# Altium schematic sheet CPU.SchDoc: Motherboard-CPU
size A3; Author: Patryk Bujak; DrawnBy: Patryk Bujak; Revision: 1.0; SheetNumber: 3; SheetTotal: 10
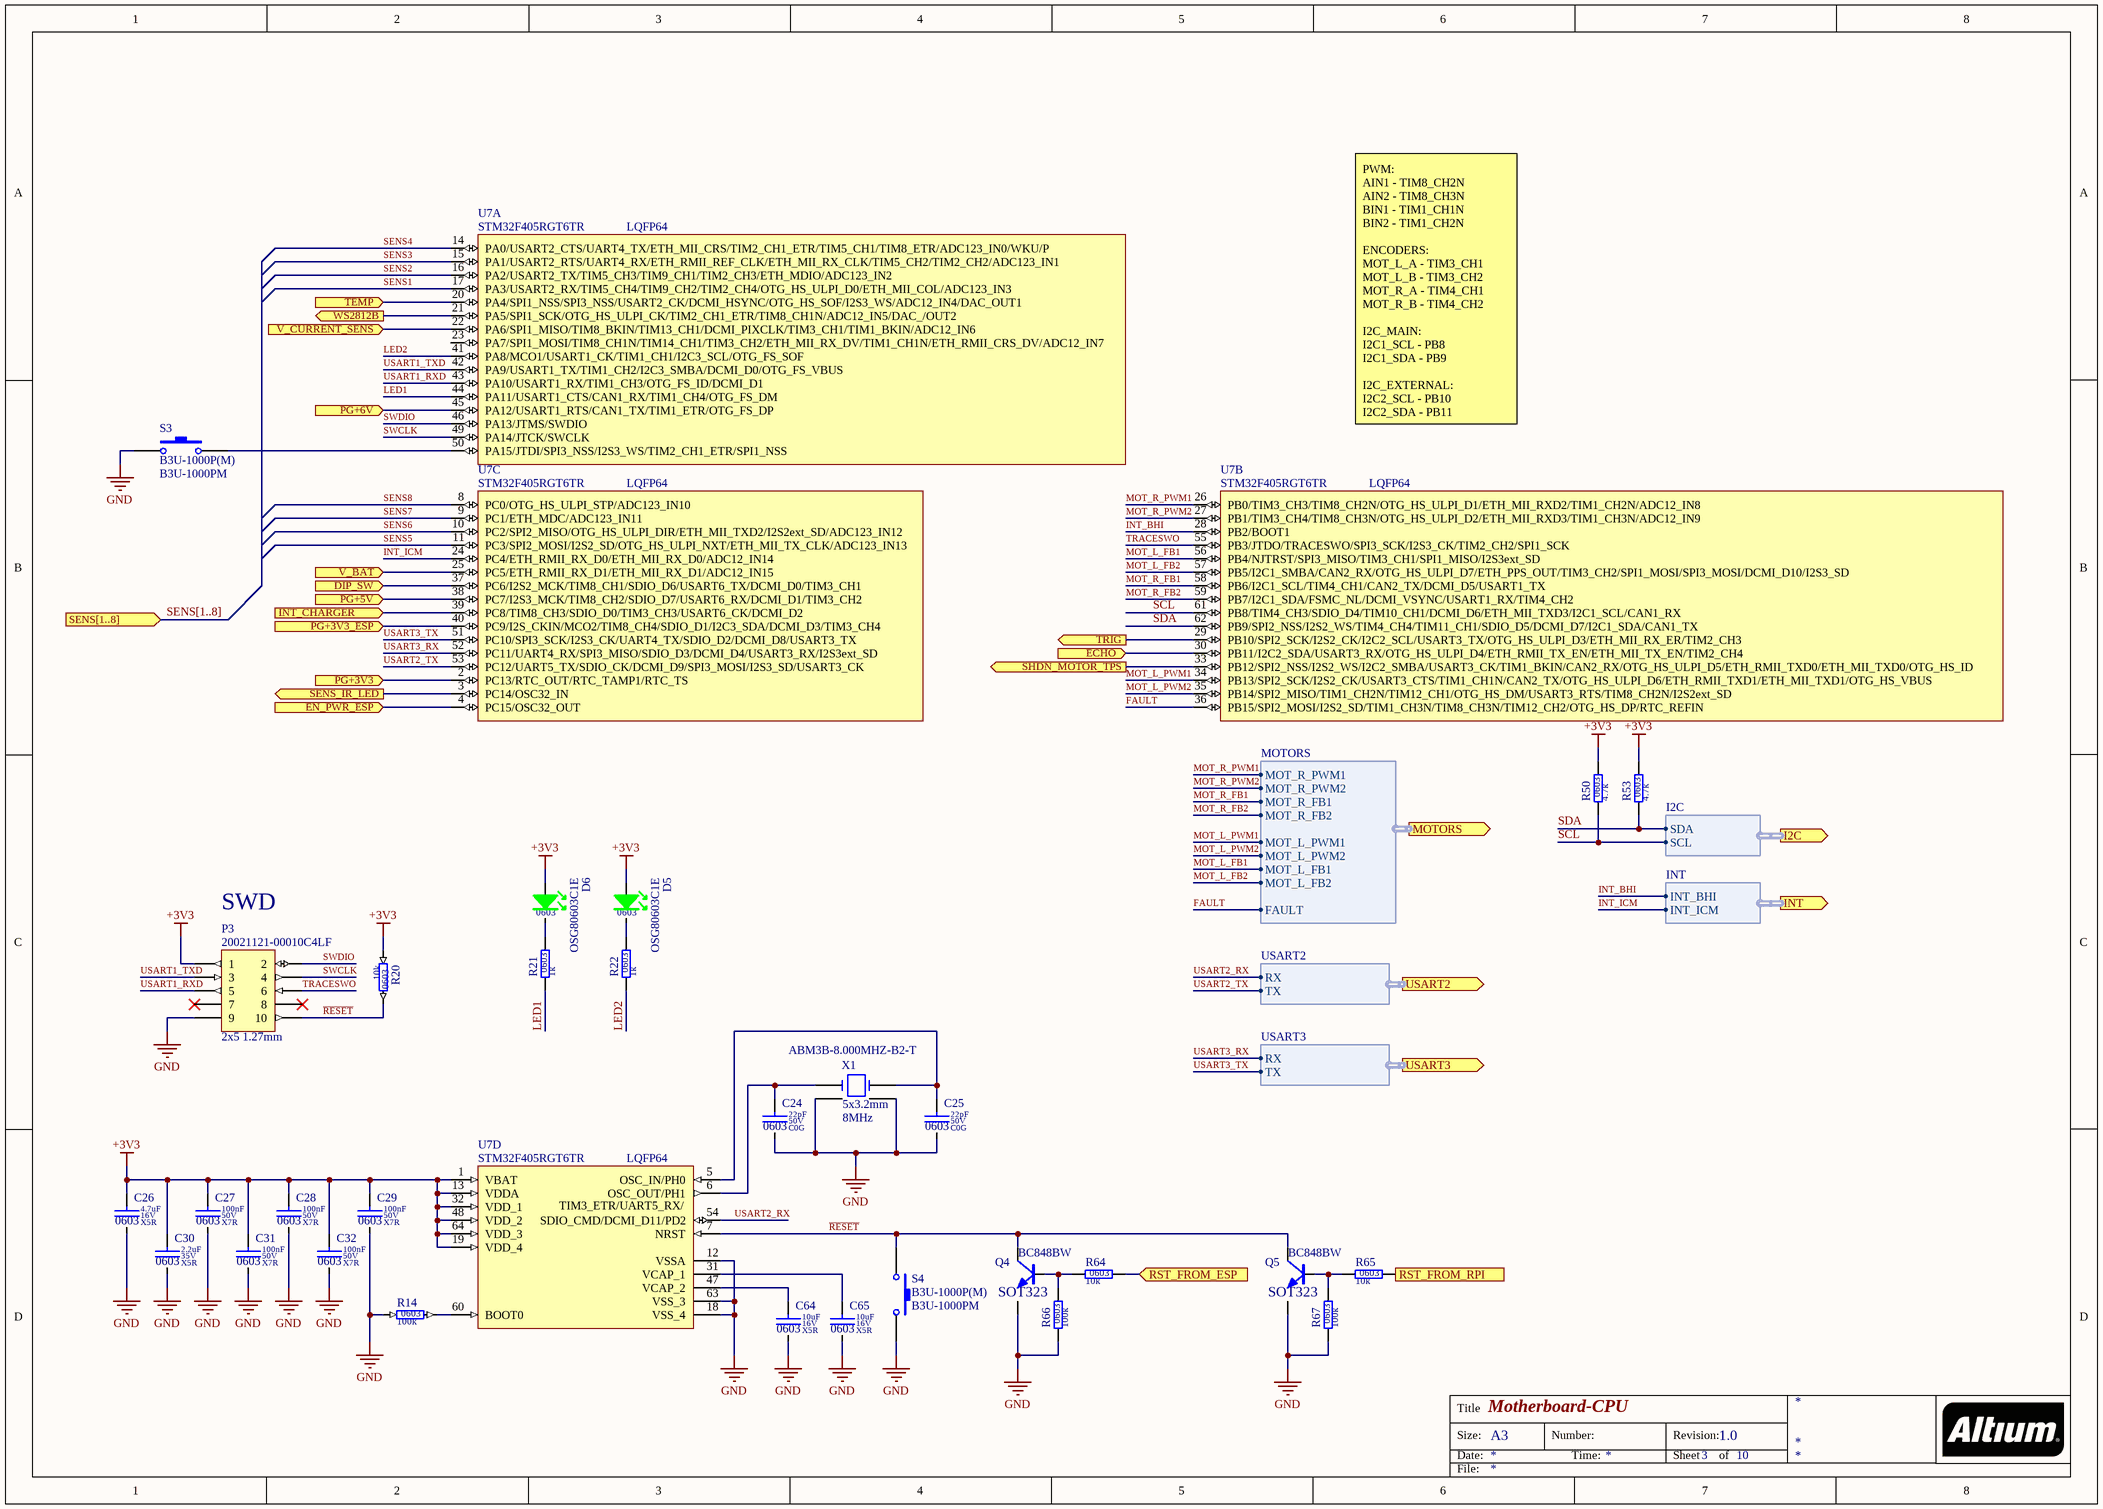
[diagram p0: CPU.SchDoc]

## Parts
C24  value 22pF  Dielectric: C0G  Voltage: 50V  SCH_Footprint: 0603  [C_0603_1608]  (hidden comment: Ceramic C0G)
C25  value 22pF  Dielectric: C0G  Voltage: 50V  SCH_Footprint: 0603  [C_0603_1608]  (hidden comment: Ceramic C0G)
C26  value 4.7uF  Dielectric: X5R  Voltage: 16V  SCH_Footprint: 0603  [C_0603_1608]  (hidden comment: Ceramic X5R)
C27  value 100nF  Dielectric: X7R  Voltage: 50V  SCH_Footprint: 0603  [C_0603_1608]  (hidden comment: Ceramic X7R)
C28  value 100nF  Dielectric: X7R  Voltage: 50V  SCH_Footprint: 0603  [C_0603_1608]  (hidden comment: Ceramic X7R)
C29  value 100nF  Dielectric: X7R  Voltage: 50V  SCH_Footprint: 0603  [C_0603_1608]  (hidden comment: Ceramic X7R)
C30  value 2.2uF  Dielectric: X5R  Voltage: 35V  SCH_Footprint: 0603  [C_0603_1608]  (hidden comment: Ceramic X5R)
C31  value 100nF  Dielectric: X7R  Voltage: 50V  SCH_Footprint: 0603  [C_0603_1608]  (hidden comment: Ceramic X7R)
C32  value 100nF  Dielectric: X7R  Voltage: 50V  SCH_Footprint: 0603  [C_0603_1608]  (hidden comment: Ceramic X7R)
C64  value 10uF  Dielectric: X5R  Voltage: 16V  SCH_Footprint: 0603  [C_0603_1608]  (hidden comment: Ceramic X5R)
C65  value 10uF  Dielectric: X5R  Voltage: 16V  SCH_Footprint: 0603  [C_0603_1608]  (hidden comment: Ceramic X5R)
D5  value OSG80603C1E  SCH_Footprint: 0603  [OL_0603_1608]  (hidden comment: Green led)
D6  value OSG80603C1E  SCH_Footprint: 0603  [OL_0603_1608]  (hidden comment: Green led)
P3  value 20021121-00010C4LF  SCH_Footprint: 2x5 1.27mm  [P_HEADER_2x5_1.27]  (hidden comment: Jtag)
Q4  SCH_Footprint: SOT323  [SOT323_SC70]  (hidden comment: BC848BW)
Q5  SCH_Footprint: SOT323  [SOT323_SC70]  (hidden comment: BC848BW)
R14  value 100k  SCH_Footprint: 0603  [R_0603_1608]  (hidden comment: Resistor)
R20  value 10k  SCH_Footprint: 0603  [R_0603_1608]  (hidden comment: Resistor)
R21  value 1k  SCH_Footprint: 0603  [R_0603_1608]  (hidden comment: Resistor)
R22  value 1k  SCH_Footprint: 0603  [R_0603_1608]  (hidden comment: Resistor)
R50  value 4.7k  SCH_Footprint: 0603  [R_0603_1608]  (hidden comment: Resistor)
R53  value 4.7k  SCH_Footprint: 0603  [R_0603_1608]  (hidden comment: Resistor)
R64  value 10k  SCH_Footprint: 0603  [R_0603_1608]  (hidden comment: Resistor)
R65  value 10k  SCH_Footprint: 0603  [R_0603_1608]  (hidden comment: Resistor)
R66  value 100k  SCH_Footprint: 0603  [R_0603_1608]  (hidden comment: Resistor)
R67  value 100k  SCH_Footprint: 0603  [R_0603_1608]  (hidden comment: Resistor)
S3  value B3U-1000PM  SCH_Footprint: B3U-1000P(M)  [B3U-1000P]  (hidden comment: Ultra-small Tactile Switch)
S4  value B3U-1000PM  SCH_Footprint: B3U-1000P(M)  [B3U-1000P]  (hidden comment: Ultra-small Tactile Switch)
U7  value STM32F405RGT6TR  SCH_Footprint: LQFP64  [LQFP64_10x10]  (hidden comment: STM32F405RBT6)  (parts A,B,C,D of 4)
X1  Manufacturer Part Number: ABM3B-8.000MHZ-B2-T  SCH_Footprint: 5x3.2mm  [X_ABM3B_5X3X11]  (hidden comment: 8MHz)

## Ports
DIP_SW (in), ECHO (in), EN_PWR_ESP (in), I2C (out, harness I2C), INT (out, harness INT), INT_CHARGER (in), MOTORS (out, harness MOTORS), PG+3V3 (in), PG+3V3_ESP (in), PG+5V (in), PG+6V (in), RST_FROM_ESP (in), RST_FROM_RPI (in), SENS[1..8] (in), SENS_IR_LED (out), SHDN_MOTOR_TPS (out), TEMP (in), TRIG (out), USART2 (out, harness USART2), USART3 (out, harness USART3), V_BAT (in), V_CURRENT_SENS (in), WS2812B (out)

## Harnesses
MOTORS: MOT_R_PWM2, MOT_L_PWM1, MOT_L_PWM2, MOT_R_PWM1, MOT_R_FB1, MOT_R_FB2, MOT_L_FB1, MOT_L_FB2, FAULT
I2C: SDA, SCL
INT: INT_BHI, INT_ICM
USART2: RX, TX
USART3: RX, TX

## Nets
+3V3: C26.1 C27.1 C28.1 C29.1 C30.1 C31.1 C32.1 D5.2(A) D6.2(A) P3.1 R20.1 R50.2 R53.2 U7.1(VBAT) U7.13(VDDA) U7.19(VDD_4) U7.32(VDD_1) U7.48(VDD_2) U7.64(VDD_3)
GND: C24.2 C25.2 C26.2 C27.2 C28.2 C29.2 C30.2 C31.2 C32.2 C64.2 C65.2 P3.9 Q4.2(E) Q5.2(E) R14.1 R66.1 R67.1 S3.1 S4.2 U7.12(VSSA) U7.18(VSS_4) U7.63(VSS_3) X1.2(GND) X1.4(GND)
DIP_SW: U7.37(PC6/I2S2_MCK/TIM8_CH1/SDIO_D6/USART6_TX/DCMI_D0/TIM3_CH1) ; port DIP_SW
ECHO: U7.30(PB11/I2C2_SDA/USART3_RX/OTG_HS_ULPI_D4/ETH_RMII_TX_EN/ETH_MII_TX_EN/TIM2_CH4) ; port ECHO
EN_PWR_ESP: U7.4(PC15/OSC32_OUT) ; port EN_PWR_ESP
FAULT: U7.36(PB15/SPI2_MOSI/I2S2_SD/TIM1_CH3N/TIM8_CH3N/TIM12_CH2/OTG_HS_DP/RTC_REFIN) ; port MOTORS.FAULT
INT_BHI: U7.28(PB2/BOOT1) ; port INT.INT_BHI
INT_CHARGER: U7.39(PC8/TIM8_CH3/SDIO_D0/TIM3_CH3/USART6_CK/DCMI_D2) ; port INT_CHARGER
INT_ICM: U7.24(PC4/ETH_RMII_RX_D0/ETH_MII_RX_D0/ADC12_IN14) ; port INT.INT_ICM
LED1: R21.1 U7.44(PA11/USART1_CTS/CAN1_RX/TIM1_CH4/OTG_FS_DM)
LED2: R22.1 U7.41(PA8/MCO1/USART1_CK/TIM1_CH1/I2C3_SCL/OTG_FS_SOF)
MOT_L_FB1: U7.56(PB4/NJTRST/SPI3_MISO/TIM3_CH1/SPI1_MISO/I2S3ext_SD) ; port MOTORS.MOT_L_FB1
MOT_L_FB2: U7.57(PB5/I2C1_SMBA/CAN2_RX/OTG_HS_ULPI_D7/ETH_PPS_OUT/TIM3_CH2/SPI1_MOSI/SPI3_MOSI/DCMI_D10/I2S3_SD) ; port MOTORS.MOT_L_FB2
MOT_L_PWM1: U7.34(PB13/SPI2_SCK/I2S2_CK/USART3_CTS/TIM1_CH1N/CAN2_TX/OTG_HS_ULPI_D6/ETH_RMII_TXD1/ETH_MII_TXD1/OTG_HS_VBUS) ; port MOTORS.MOT_L_PWM1
MOT_L_PWM2: U7.35(PB14/SPI2_MISO/TIM1_CH2N/TIM12_CH1/OTG_HS_DM/USART3_RTS/TIM8_CH2N/I2S2ext_SD) ; port MOTORS.MOT_L_PWM2
MOT_R_FB1: U7.58(PB6/I2C1_SCL/TIM4_CH1/CAN2_TX/DCMI_D5/USART1_TX) ; port MOTORS.MOT_R_FB1
MOT_R_FB2: U7.59(PB7/I2C1_SDA/FSMC_NL/DCMI_VSYNC/USART1_RX/TIM4_CH2) ; port MOTORS.MOT_R_FB2
MOT_R_PWM1: U7.26(PB0/TIM3_CH3/TIM8_CH2N/OTG_HS_ULPI_D1/ETH_MII_RXD2/TIM1_CH2N/ADC12_IN8) ; port MOTORS.MOT_R_PWM1
MOT_R_PWM2: U7.27(PB1/TIM3_CH4/TIM8_CH3N/OTG_HS_ULPI_D2/ETH_MII_RXD3/TIM1_CH3N/ADC12_IN9) ; port MOTORS.MOT_R_PWM2
PG+3V3: U7.2(PC13/RTC_OUT/RTC_TAMP1/RTC_TS) ; port PG+3V3
PG+3V3_ESP: U7.40(PC9/I2S_CKIN/MCO2/TIM8_CH4/SDIO_D1/I2C3_SDA/DCMI_D3/TIM3_CH4) ; port PG+3V3_ESP
PG+5V: U7.38(PC7/I2S3_MCK/TIM8_CH2/SDIO_D7/USART6_RX/DCMI_D1/TIM3_CH2) ; port PG+5V
PG+6V: U7.45(PA12/USART1_RTS/CAN1_TX/TIM1_ETR/OTG_FS_DP) ; port PG+6V
~{RESET}: P3.10 Q4.3(C) Q5.3(C) R20.2 S4.1 U7.7(NRST)
RST_FROM_ESP: R64.2 ; port RST_FROM_ESP
RST_FROM_RPI: R65.2 ; port RST_FROM_RPI
SCL: R50.1 U7.61(PB8/TIM4_CH3/SDIO_D4/TIM10_CH1/DCMI_D6/ETH_MII_TXD3/I2C1_SCL/CAN1_RX) ; port I2C.SCL
SDA: R53.1 U7.62(PB9/SPI2_NSS/I2S2_WS/TIM4_CH4/TIM11_CH1/SDIO_D5/DCMI_D7/I2C1_SDA/CAN1_TX) ; port I2C.SDA
SENS1: U7.17(PA3/USART2_RX/TIM5_CH4/TIM9_CH2/TIM2_CH4/OTG_HS_ULPI_D0/ETH_MII_COL/ADC123_IN3)
SENS2: U7.16(PA2/USART2_TX/TIM5_CH3/TIM9_CH1/TIM2_CH3/ETH_MDIO/ADC123_IN2)
SENS3: U7.15(PA1/USART2_RTS/UART4_RX/ETH_RMII_REF_CLK/ETH_MII_RX_CLK/TIM5_CH2/TIM2_CH2/ADC123_IN1)
SENS4: U7.14(PA0/USART2_CTS/UART4_TX/ETH_MII_CRS/TIM2_CH1_ETR/TIM5_CH1/TIM8_ETR/ADC123_IN0/WKU/P)
SENS5: U7.11(PC3/SPI2_MOSI/I2S2_SD/OTG_HS_ULPI_NXT/ETH_MII_TX_CLK/ADC123_IN13)
SENS6: U7.10(PC2/SPI2_MISO/OTG_HS_ULPI_DIR/ETH_MII_TXD2/I2S2ext_SD/ADC123_IN12)
SENS7: U7.9(PC1/ETH_MDC/ADC123_IN11)
SENS8: U7.8(PC0/OTG_HS_ULPI_STP/ADC123_IN10)
SENS_IR_LED: U7.3(PC14/OSC32_IN) ; port SENS_IR_LED
SHDN_MOTOR_TPS: U7.33(PB12/SPI2_NSS/I2S2_WS/I2C2_SMBA/USART3_CK/TIM1_BKIN/CAN2_RX/OTG_HS_ULPI_D5/ETH_RMII_TXD0/ETH_MII_TXD0/OTG_HS_ID) ; port SHDN_MOTOR_TPS
SWCLK: P3.4 U7.49(PA14/JTCK/SWCLK)
SWDIO: P3.2 U7.46(PA13/JTMS/SWDIO)
TEMP: U7.20(PA4/SPI1_NSS/SPI3_NSS/USART2_CK/DCMI_HSYNC/OTG_HS_SOF/I2S3_WS/ADC12_IN4/DAC_OUT1) ; port TEMP
TRACESWO: P3.6 U7.55(PB3/JTDO/TRACESWO/SPI3_SCK/I2S3_CK/TIM2_CH2/SPI1_SCK)
TRIG: U7.29(PB10/SPI2_SCK/I2S2_CK/I2C2_SCL/USART3_TX/OTG_HS_ULPI_D3/ETH_MII_RX_ER/TIM2_CH3) ; port TRIG
USART1_RXD: P3.5 U7.43(PA10/USART1_RX/TIM1_CH3/OTG_FS_ID/DCMI_D1)
USART1_TXD: P3.3 U7.42(PA9/USART1_TX/TIM1_CH2/I2C3_SMBA/DCMI_D0/OTG_FS_VBUS)
USART2_RX: U7.54(SDIO_CMD/DCMI_D11/PD2) ; port USART2.RX
USART2_TX: U7.53(PC12/UART5_TX/SDIO_CK/DCMI_D9/SPI3_MOSI/I2S3_SD/USART3_CK) ; port USART2.TX
USART3_RX: U7.52(PC11/UART4_RX/SPI3_MISO/SDIO_D3/DCMI_D4/USART3_RX/I2S3ext_SD) ; port USART3.RX
USART3_TX: U7.51(PC10/SPI3_SCK/I2S3_CK/UART4_TX/SDIO_D2/DCMI_D8/USART3_TX) ; port USART3.TX
V_BAT: U7.25(PC5/ETH_RMII_RX_D1/ETH_MII_RX_D1/ADC12_IN15) ; port V_BAT
V_CURRENT_SENS: U7.22(PA6/SPI1_MISO/TIM8_BKIN/TIM13_CH1/DCMI_PIXCLK/TIM3_CH1/TIM1_BKIN/ADC12_IN6) ; port V_CURRENT_SENS
WS2812B: U7.21(PA5/SPI1_SCK/OTG_HS_ULPI_CK/TIM2_CH1_ETR/TIM8_CH1N/ADC12_IN5/DAC_/OUT2) ; port WS2812B
NetC24_1: C24.1 U7.6(OSC_OUT/PH1) X1.3
NetC25_1: C25.1 U7.5(OSC_IN/PH0) X1.1
NetC64_1: C64.1 U7.47(VCAP_2)
NetC65_1: C65.1 U7.31(VCAP_1)
NetD5_1: D5.1(K) R22.2
NetD6_1: D6.1(K) R21.2
NetQ4_1: Q4.1(B) R64.1 R66.2
NetQ5_1: Q5.1(B) R65.1 R67.2
NetR14_2: R14.2 U7.60(BOOT0)
NetS3_2: S3.2 U7.50(PA15/JTDI/SPI3_NSS/I2S3_WS/TIM2_CH1_ETR/SPI1_NSS)

Not connected (* = marked no-connect by the designer): P3 7* 8*; U7 23(PA7/SPI1_MOSI/TIM8_CH1N/TIM14_CH1/TIM3_CH2/ETH_MII_RX_DV/TIM1_CH1N/ETH_RMII_CRS_DV/ADC12_IN7)

## Buses and harness runs
bus SENS[1..8] = port SENS[1..8]

## Notes on the sheet
- PWM:
  AIN1 - TIM8_CH2N
  AIN2 - TIM8_CH3N
  BIN1 - TIM1_CH1N
  BIN2 - TIM1_CH2N
  ENCODERS:
  MOT_L_A - TIM3_CH1
  MOT_L_B - TIM3_CH2
  MOT_R_A - TIM4_CH1
  MOT_R_B - TIM4_CH2
  I2C_MAIN:
  I2C1_SCL - PB8
  I2C1_SDA - PB9
  I2C_EXTERNAL:
  I2C2_SCL - PB10
  I2C2_SDA - PB11
- (near P3) SWD
- Title
- Size:
- Date:
- A3
- Number:
- Time:
- Revision:
- Sheet
- of
- File:
- (in symbol UP_STM32F405RGT6TR, part D) TIM3_ETR/UART5_RX/

## Library data of the parts
C24 C25 = C_22pF_50V_C0G_0603_5: Capacitor; Manufacturer: Yageo; Manufacturer Part Number: CC0603JRNPO9BN220; Tolerance (%): 5; Part Number: C_22pF_50V_C0G_0603_5; HelpURL: https://datasheet.octopart.com/CC0603JRNPO9BN220-Yageo-datasheet-136957424.pdf; Supplier 1: TME; Supplier Part Number 1: CC0603JRNPO9220; Supplier 2: RS Components; Supplier 3: Farnell; Supplier Part Number 3: 722005; Supplier 4: Mouser; Supplier Part Number 4: 603-CC603JRNPO9BN220; Supplier 5: Digi-Key; Supplier Part Number 5: 311-1062-1-ND; Supplier 6: LCSC
C26 = C_4.7uF_16V_X5R_0603_10: Capacitor; Manufacturer: Murata; Manufacturer Part Number: GRM188R61C475KAAJD; Tolerance (%): 10; Part Number: C_4.7uF_16V_X5R_0603_10; HelpURL: https://datasheet.octopart.com/GRM188R61C475KAAJD-Murata-datasheet-66077093.pdf; Supplier 1: TME; Supplier 2: RS Components; Supplier Part Number 2: 884-7264P; Supplier 3: Farnell; Supplier Part Number 3: 2611924; Supplier 4: Mouser; Supplier Part Number 4: 81-GRM188R61C475KAJD; Supplier 5: Digi-Key; Supplier Part Number 5: 490-10481-2-ND; Supplier 6: LCSC
C27-C29 C31 C32 = C_100nF_50V_X7R_0603_5: Capacitor; Manufacturer: Samsung; Manufacturer Part Number: CL10B104JB8NNNC; Tolerance (%): 5; Part Number: C_100nF_50V_X7R_0603_5; HelpURL: http://www.tme.eu/pl/Document/4a42202b32dab16128fe107dd69598cc/samsung-chip-cap.pdf; Supplier 1: TME; Supplier Part Number 1: CL10B104JB8NNNC; Supplier 2: RS Components; Supplier Part Number 2: 7665455; Supplier 3: Farnell; Supplier 4: Mouser; Supplier 5: Digi-Key; Supplier Part Number 5: 1276-1033-1-ND; Supplier 6: LCSC; Supplier Part Number 6: C24452
C30 = C_2.2uF_35V_X5R_0603_10: Capacitor; Manufacturer: Murata; Manufacturer Part Number: GRM188R6YA225KA12D; Tolerance (%): 10; Part Number: C_2.2uF_35V_X5R_0603_10; HelpURL: https://datasheet.octopart.com/GRM188R6YA225KA12D-Murata-datasheet-66077095.pdf; Supplier 1: TME; Supplier 2: RS Components; Supplier Part Number 2: 8151358; Supplier 3: Farnell; Supplier Part Number 3: 2611926; Supplier 4: Mouser; Supplier Part Number 4: 81-GRM188R6YA225KA2D; Supplier 5: Digi-Key; Supplier Part Number 5: 490-7204-1-ND; Supplier 6: LCSC
C64 C65 = C_10uF_16V_X5R_0603_20: Capacitor; Manufacturer: Samsung Electro-Mechanics; Manufacturer Part Number: CL10A106MO8NQNC; Tolerance (%): 20; Part Number: C_10uF_16V_X5R_0603_20; HelpURL: http://www.tme.eu/pl/Document/4a42202b32dab16128fe107dd69598cc/samsung-chip-cap.pdf; Supplier 1: TME; Supplier Part Number 1: CL10A106MO8NQNC; Supplier 2: RS Components; Supplier 3: Farnell; Supplier 4: Mouser; Supplier 5: Digi-Key; Supplier 6: LCSC
D5 D6 = OL_G_0603_OSG80603C1E: LED GREEN; Manufacturer: Optosupply; Part Number: OL_G_0603_OSG80603C1E; Manufacturer Part Number: OSG80603C1E; Supplier 1: TME; Supplier Part Number 1: OSG80603C1E; Supplier 2: RS Components; Supplier 3: Farnell; Supplier 4: Mouser; Supplier 5: Digi-Key; Supplier 6: LCSC
P3 = P_HEADER_2x5_1.27: Pin Header; Manufacturer: FCI; Part Number: P_HEADER_2x5_1.27; HelpURL: http://www.mouser.com/catalog/645/usd/1591.pdf; Manufacturer Part Number: 20021121-00010C4LF; Supplier 1: TME; Supplier Part Number 1: 20021121-00010C4LF; Supplier 2: RS Components; Supplier Part Number 2: 794-4584; Supplier 3: Farnell; Supplier Part Number 3: 1865279; Supplier 4: Mouser; Supplier Part Number 4: 649-202112100010C4LF; Supplier 5: Digi-Key; Supplier Part Number 5: 609-3695-1-ND; Supplier 6: LCSC
Q4 Q5 = QNP_BC848BW_30V_0A1: Manufacturer: Diotec Semiconductor; Type: NPN; Voltage: 30V; Current: 0A1; Part Number: QNP_BC848BW_30V_0A1; Value: BC848BW; HelpURL: http://www.tme.eu/pl/Document/6f749a16562a2a0770a5550dd3f478bf/bc846w.pdf; Manufacturer Part Number: BC848BW; Supplier 1: TME; Supplier Part Number 1: BC848BW-DIO; Supplier 2: RS Components; Supplier 3: Farnell; Supplier 4: Mouser; Supplier 5: Digi-Key; Supplier 6: LCSC
R14 R66 R67 = R_100k_0603_1: Manufacturer: Royalohm; Manufacturer Part Number: 0603SAF1003T5E; Voltage: 50V; Power: 100mW; Tolerance: 1%; Part Number: R_100k_0603_1; HelpURL: http://www.tme.eu/pl/Document/b315665a56acbc42df513c99b390ad98/ROYALOHM-THICKFILM.pdf; Supplier 1: TME; Supplier Part Number 1: SMD0603-100K-1%; Supplier 2: RS Components; Supplier 3: Farnell; Supplier 4: Mouser; Supplier Part Number 4: 667-ERJ-3EKF1003V; Supplier 5: Digi-Key; Supplier Part Number 5: P100KHCT-ND; Supplier 6: LCSC
R20 R64 R65 = R_10k_0603_1: Manufacturer: Vishay; Manufacturer Part Number: CRCW060310K0FKTABC; Voltage: 75V; Power: 100mW; Tolerance: 1%; Part Number: R_10k_0603_1; HelpURL: http://www.tme.eu/pl/Document/622e28308c06d160637f2b14751ba16b/Data%20Sheet%20CRCW_BCe3.pdf; Supplier 1: TME; Supplier Part Number 1: CRCW060310K0FKTABC; Supplier 2: RS Components; Supplier 3: Farnell; Supplier 4: Mouser; Supplier Part Number 4: 667-ERJ-3EKF1002V; Supplier 5: Digi-Key; Supplier Part Number 5: P10KGCT-ND; Supplier 6: LCSC
R21 R22 = R_1k_0603_1: Manufacturer: Vishay; Manufacturer Part Number: CRCW06031K00FKEA; Voltage: 75V; Power: 100mW; Tolerance: 1%; Part Number: R_1k_0603_1; HelpURL: http://www.farnell.com/datasheets/2310790.pdf?_ga=2.256888843.1690599162.1548417389-1379097396.1542296996&_gac=1.262631934.1547230258.Cj0KCQiAmuHhBRD0ARIsAFWyPwhX8HcvXnM3tA0ZBodZLzDIjH2ZxLpjT5LWo9bad_HPRbU8LfPq44UaAhEwEALw_wcB; Supplier 1: TME; Supplier 2: RS Components; Supplier Part Number 2: 678-9875P; Supplier 3: Farnell; Supplier Part Number 3: 1469740; Supplier 4: Mouser; Supplier Part Number 4: 71-CRCW0603-1.0K-E3; Supplier 5: Digi-Key; Supplier Part Number 5: 541-1.00KHCT-ND; Supplier 6: LCSC
R50 R53 = R_4.7k_0603_1: Manufacturer: Yageo; Manufacturer Part Number: RC0603FR-074K7L; Voltage: 75V; Power: 100mW; Tolerance: 1%; Part Number: R_4.7k_0603_1; HelpURL: http://www.farnell.com/datasheets/2167052.pdf?_ga=2.156163131.1690599162.1548417389-1379097396.1542296996&_gac=1.18389067.1547230258.Cj0KCQiAmuHhBRD0ARIsAFWyPwhX8HcvXnM3tA0ZBodZLzDIjH2ZxLpjT5LWo9bad_HPRbU8LfPq44UaAhEwEALw_wcB; Supplier 1: TME; Supplier Part Number 1: RC0603FR-074K7; Supplier 2: RS Components; Supplier 3: Farnell; Supplier Part Number 3: 9238565; Supplier 4: Mouser; Supplier Part Number 4: 603-RC0603FR-074K7L; Supplier 5: Digi-Key; Supplier Part Number 5: 311-4.70KHRCT-ND; Supplier 6: LCSC
S3 S4 = S_B3U-1000PM: Tact Switch; Manufacturer: OMRON; Part Number: S_B3U-1000PM; HelpURL: https://www.tme.eu/Document/abdade7e1ca56d20235b5c747d7227eb/B3U.PDF; Manufacturer Part Number: B3U-1000PM; Supplier 1: TME; Supplier Part Number 1: B3U-1000PM; Supplier 2: RS Components; Supplier 3: Farnell; Supplier 4: Mouser; Supplier Part Number 4: 653-B3U-1000PM; Supplier 5: Digi-Key; Supplier 6: LCSC
U7 = UP_STM32F405RGT6TR: Manufacturer: STMicroelectronics; Part Number: UP_STM32F405RGT6TR; HelpURL: https://datasheet.octopart.com/STM32F405RGT6TR-STMicroelectronics-datasheet-12357803.pdf; Manufacturer Part Number: STM32F405RGT6TR; Supplier 1: TME; Supplier Part Number 1: STM32F405RGT6TR; Supplier 2: RS Components; Supplier Part Number 2: 7926013; Supplier 3: Farnell; Supplier Part Number 3: 3129633; Supplier 4: Mouser; Supplier Part Number 4: 511-STM32F405RGT6TR; Supplier 5: Digi-Key; Supplier Part Number 5: 497-17432-6-ND; Supplier 6: LCSC
X1 = X_ABM3B-8.000MHZ-B2-T: Manufacturer: Abracon; Part Number: X_ABM3B-8.000MHZ-B2-T; Value: 8MHz; HelpURL: https://datasheet.octopart.com/ABM3B-8.000MHZ-B2-T-Abracon-datasheet-12510201.pdf; Supplier 1: TME; Supplier Part Number 1: ABM3B-8.000MHZ-B2; Supplier 2: RS Components; Supplier Part Number 2: 171-0644; Supplier 3: Farnell; Supplier Part Number 3: 2467818; Supplier 4: Mouser; Supplier Part Number 4: 815-ABM3B-8.0-B2-T; Supplier 5: Digi-Key; Supplier Part Number 5: 535-9720-1-ND; Supplier 6: LCSC